# EAGLE board MainECU rev12 (EAGLE 9.6.2), part 1 of 2
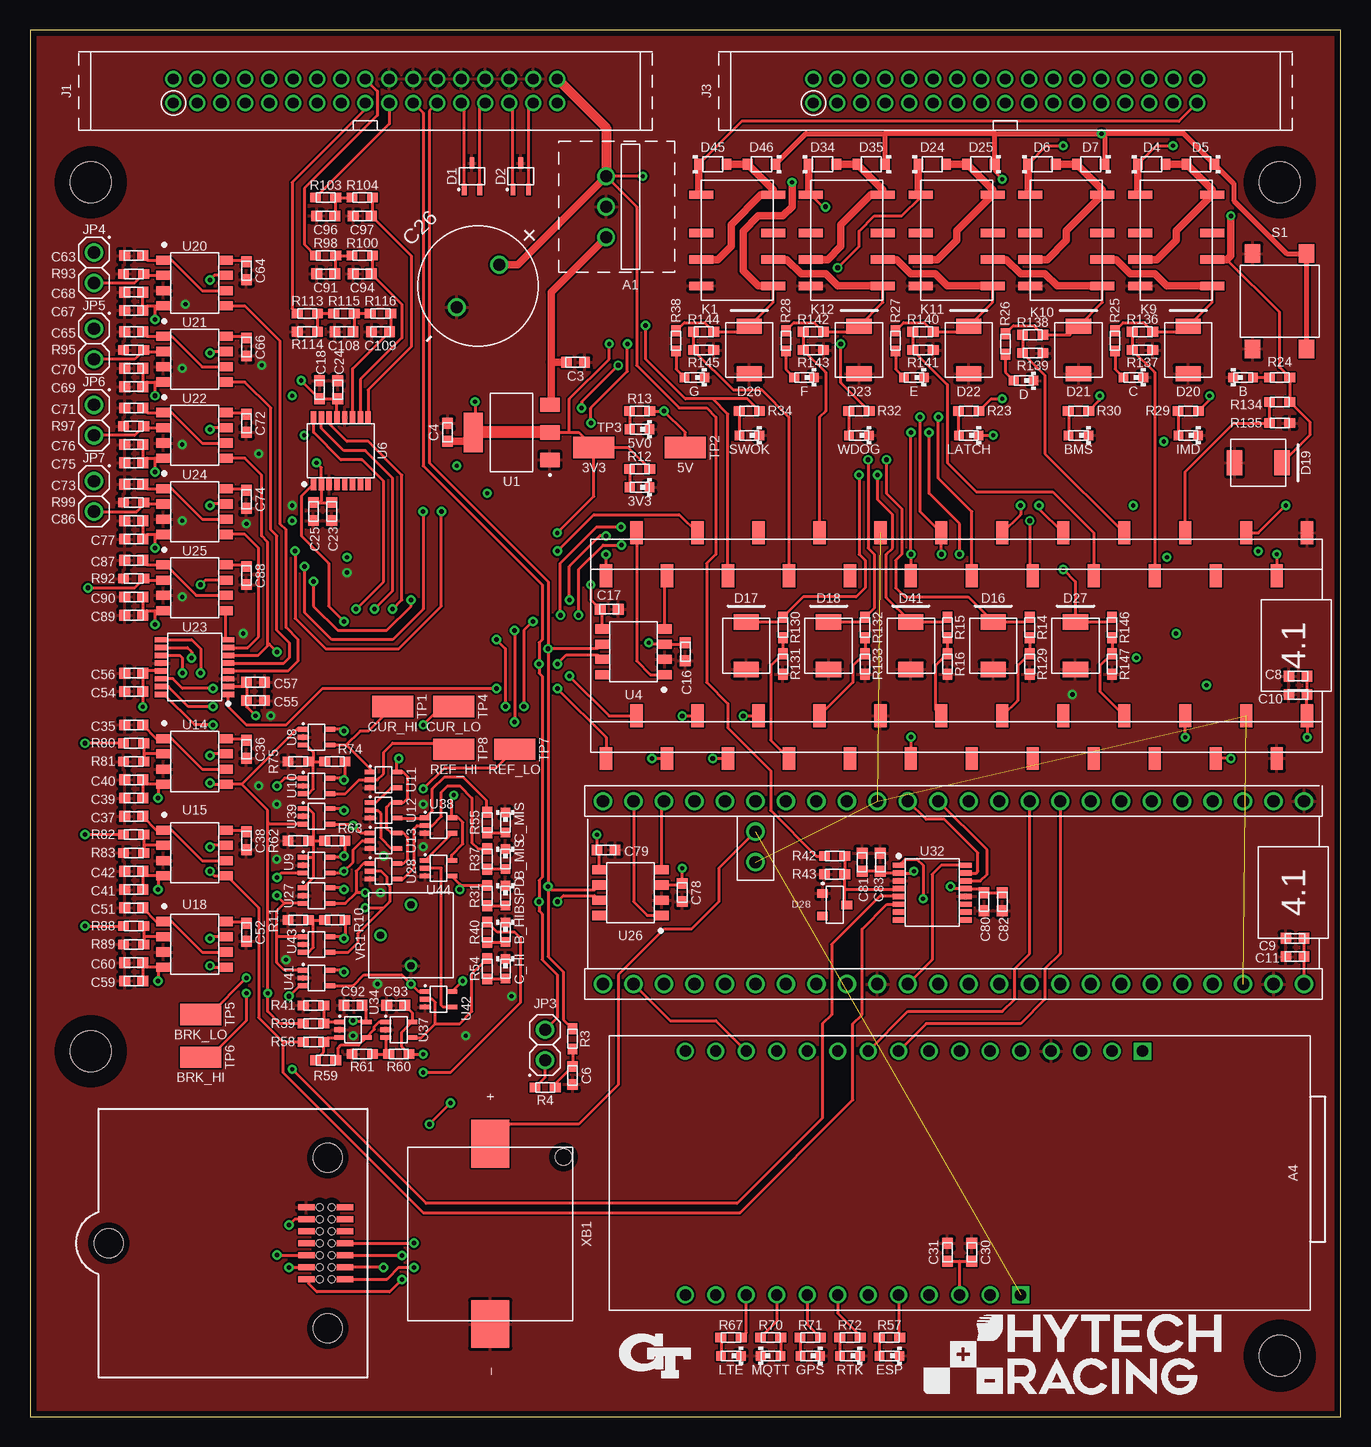
[diagram p8: board, top side]
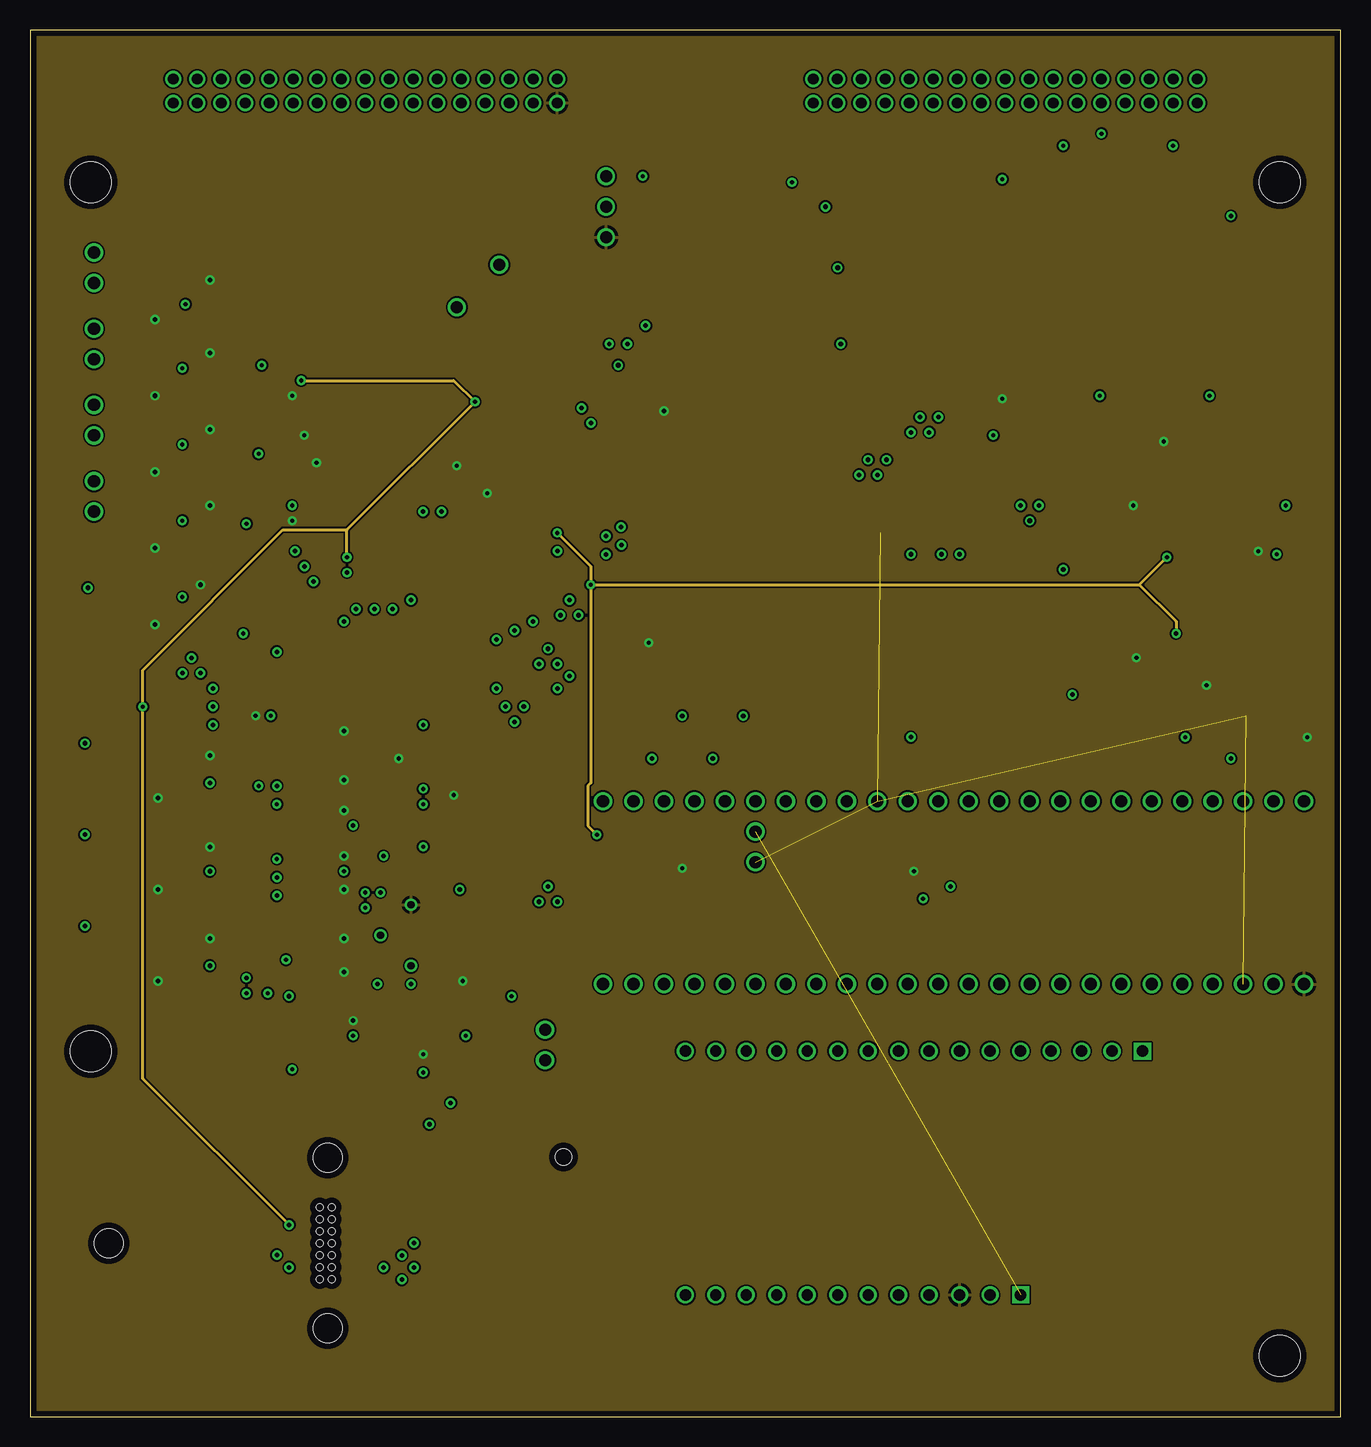
[diagram p9: board, inner layer Route2]
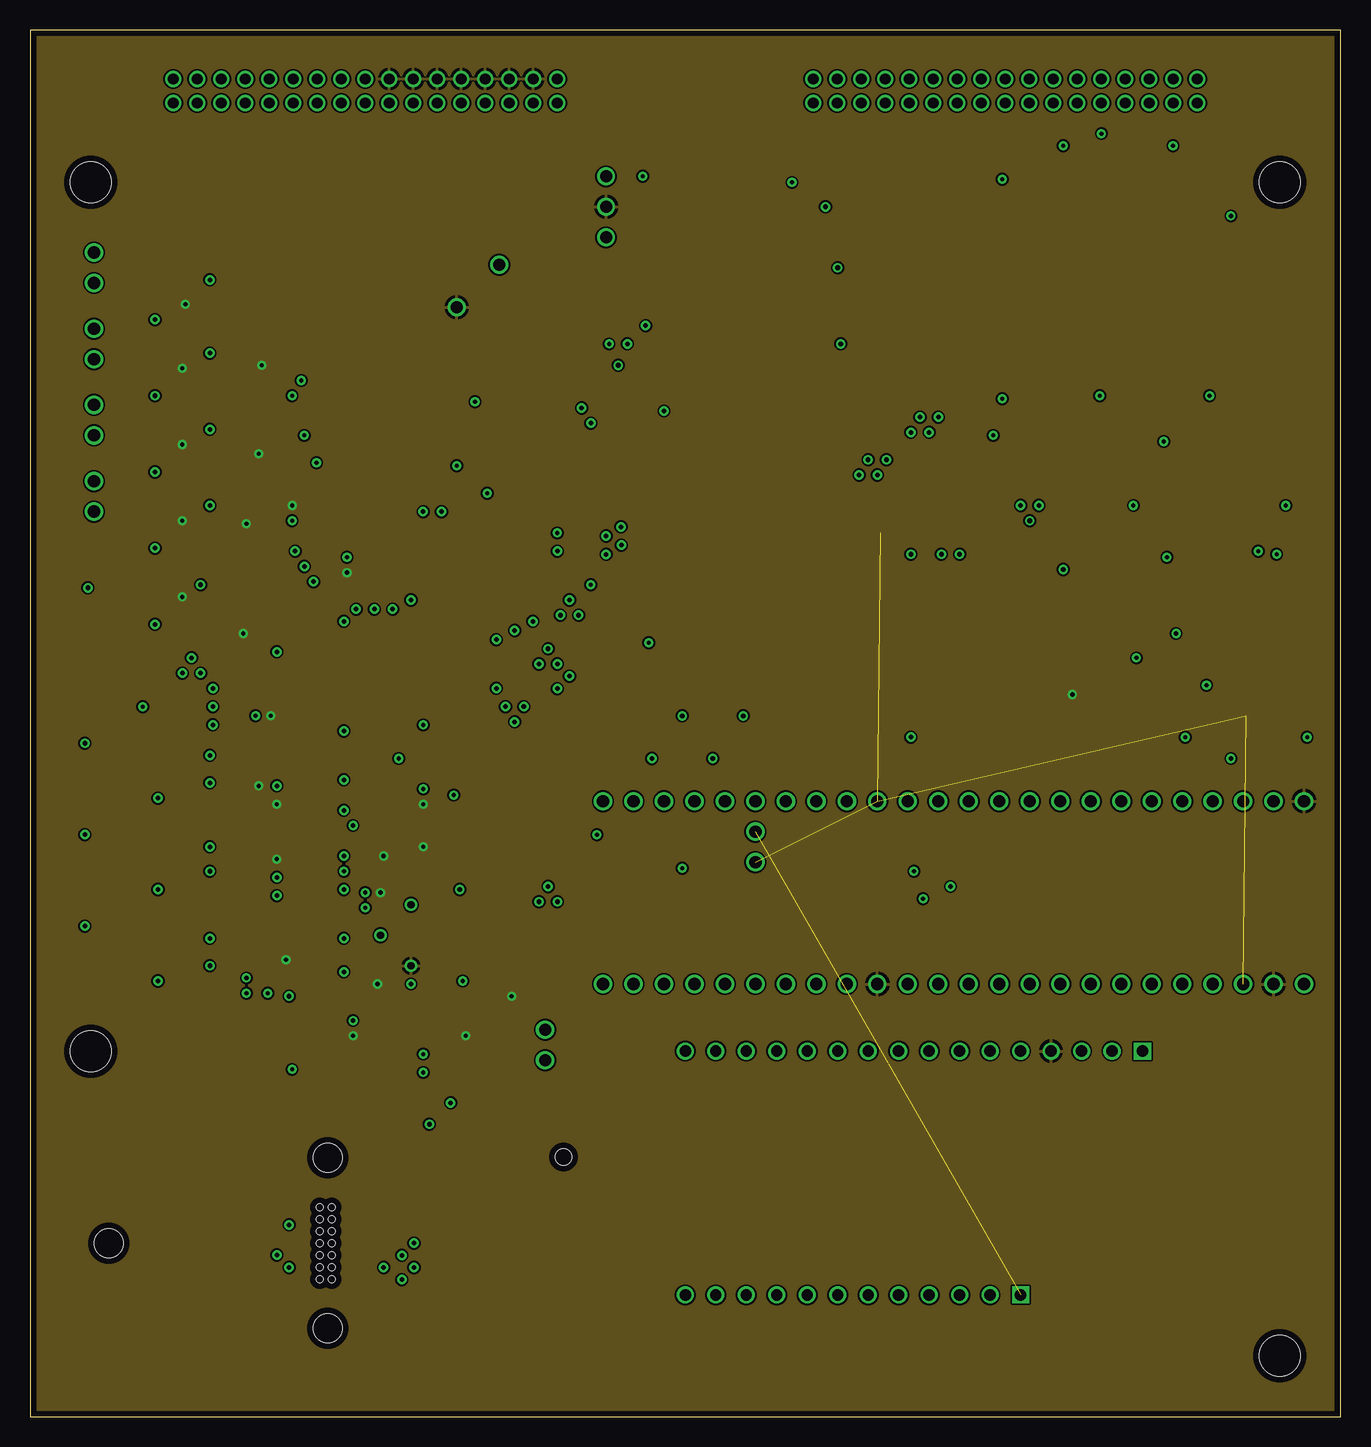
[diagram p10: board, inner layer Route15]
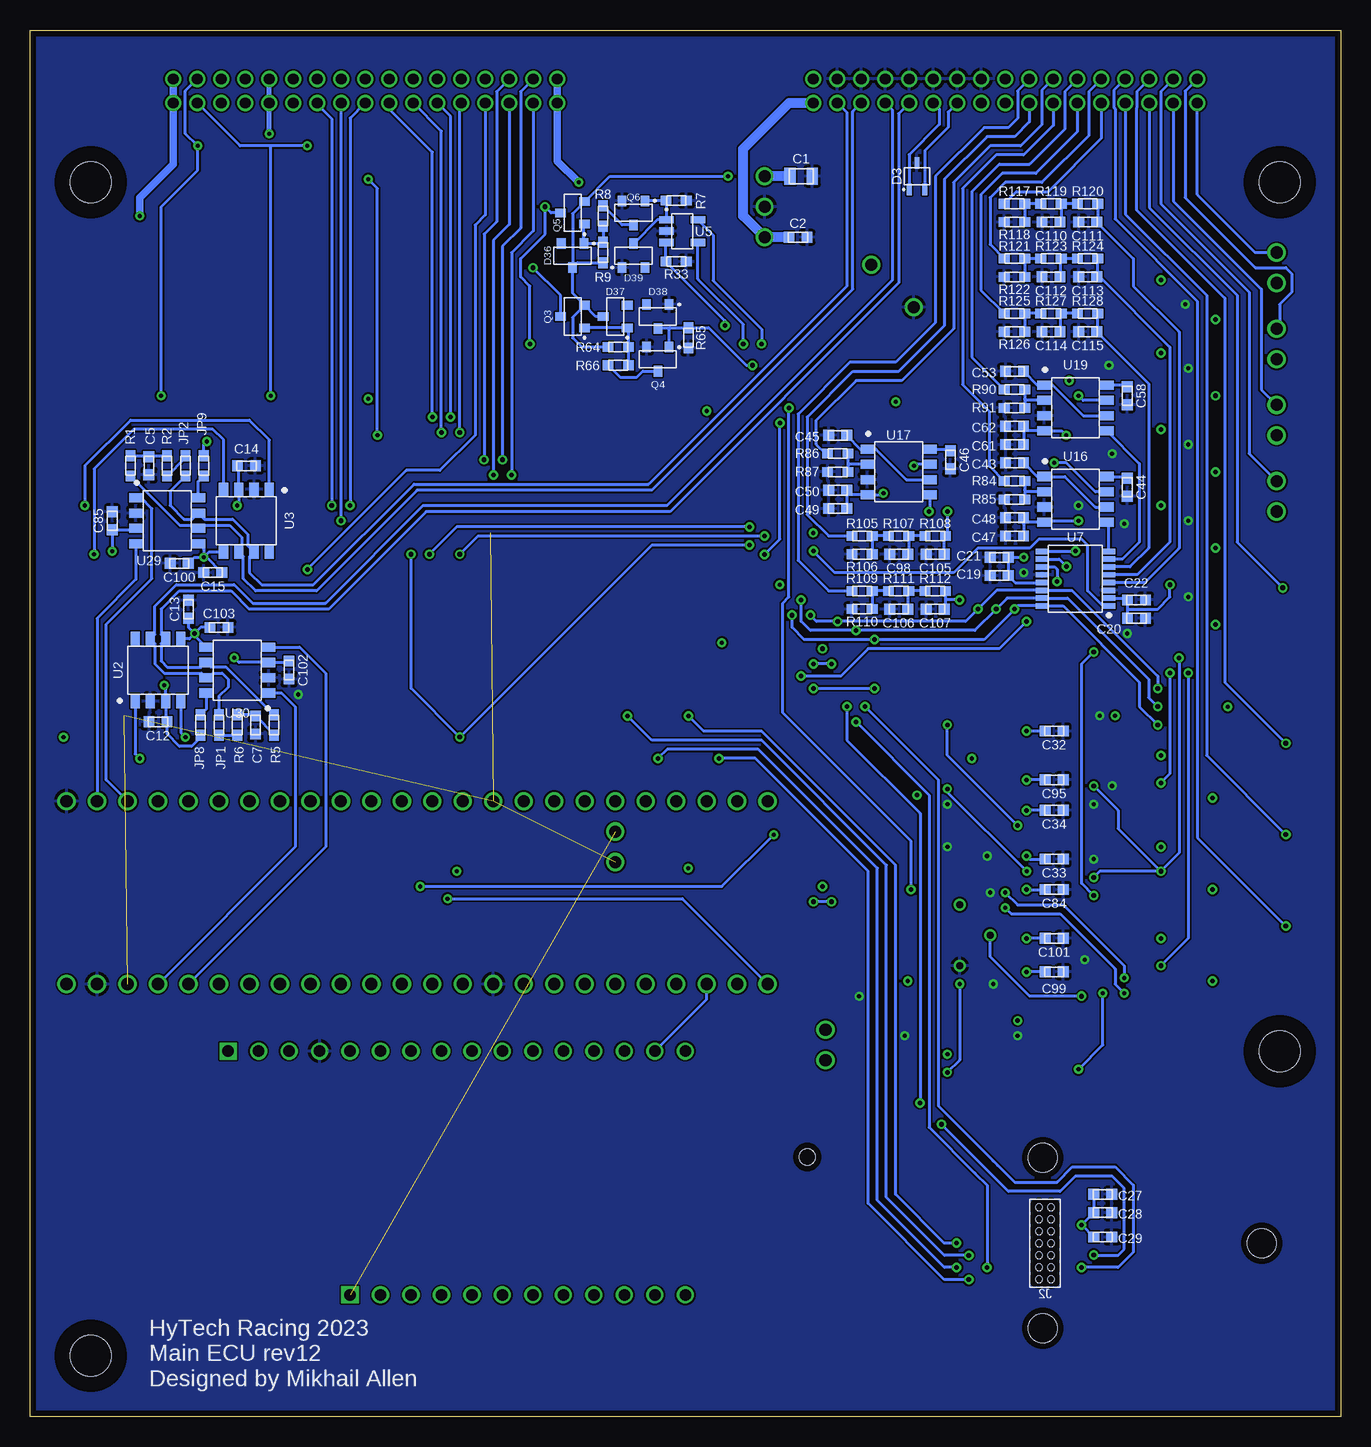
[diagram p11: board, bottom side, seen from below]

Size 109.22 x 115.57 mm. Coordinates in mm from the lower left corner, seen from the top.
Outline: 0,0 109.22,0 109.22,115.57 0,115.57 0,0
Copper layers (1+2*15+16): Top 0.035mm / dielectric 0.2mm / Route2 0.0175mm / dielectric 1.065mm / Route15 0.0175mm / dielectric 0.2mm / Bottom 0.035mm
Design rules "HyTech Default (4 Layer)": minimum track width 6mil, minimum drill 10mil, track to track 6mil, track to pad 6mil, pad to pad 6mil, via to via 20mil, smd to smd 6mil, copper to edge 20mil, drill to drill 21mil, minimum pad ring 8mil, minimum via ring 8mil, stop-mask expansion 3mil, vias tented up to drill 30mil, thermal gap 10mil

## Footprints (pad centres in the part's own frame; a part is rotated, then mirrored left to right if it is on the bottom)
0603-LED = smd 0.8 x 0.8: 1 -0.825,0; 2 0.825,0
OKI-78SR = drill 0.991: 1 -2.54,0; 2 0,0; 3 2.54,0
TEENSY_LONG_SSM = smd 1.905 x 1.02: 3.3V -5.842,-24.13; 3.3V@1 9.398,6.35; AGND/GND -9.398,-26.67; D0 5.842,-26.67; D1 9.398,-24.13; D2 5.842,-21.59; D3 9.398,-19.05; D4 5.842,-16.51; D5 9.398,-13.97; D6 5.842,-11.43; D7 9.398,-8.89; D8 5.842,-6.35; D9 9.398,-3.81; D10 5.842,-1.27; D11 9.398,1.27; D12 5.842,3.81; D13 -9.398,3.81; D14 -5.842,1.27; D15 -9.398,-1.27; D16 -5.842,-3.81; D17 -9.398,-6.35; D18 -5.842,-8.89; D19 -9.398,-11.43; D20 -5.842,-13.97; D21 -9.398,-16.51; D22 -5.842,-19.05; D23 -9.398,-21.59; D24 5.842,8.89; D25 9.398,11.43; D26 5.842,13.97; D27 9.398,16.51; D28 5.842,19.05; D29 9.398,21.59; D30 5.842,24.13; D31 9.398,26.67; D32 5.842,29.21; D33 -9.398,29.21; D34 -5.842,26.67; D35 -9.398,24.13; D36 -5.842,21.59; D37 -9.398,19.05; D38 -5.842,16.51; D39 -9.398,13.97; D40 -5.842,11.43; D41 -9.398,8.89; GND 9.398,-29.21; GND@1 -5.842,6.35; VIN -5.842,-29.21
TEENSY_LONG_EXT = drill 1.016: 3V3 0,5.08; 3V3@2 15.24,35.56; 3V3@3 10.16,45.72; AGND/GND 0,2.54; D0 15.24,2.54; D1 15.24,5.08; D2 15.24,7.62; D3 15.24,10.16; D4 15.24,12.7; D5 15.24,15.24; D6 15.24,17.78; D7 15.24,20.32; D8 15.24,22.86; D9 15.24,25.4; D10 15.24,27.94; D11 15.24,30.48; D12 15.24,33.02; D13 0,33.02; D14 0,30.48; D15 0,27.94; D16 0,25.4; D17 0,22.86; D18 0,20.32; D19 0,17.78; D20 0,15.24; D21 0,12.7; D22 0,10.16; D23 0,7.62; D24 15.24,38.1; D25 15.24,40.64; D26 15.24,43.18; D27 15.24,45.72; D28 15.24,48.26; D29 15.24,50.8; D30 15.24,53.34; D31 15.24,55.88; D32 15.24,58.42; D33 0,58.42; D34 0,55.88; D35 0,53.34; D36 0,50.8; D37 0,48.26; D38 0,45.72; D39 0,43.18; D40 0,40.64; D41 0,38.1; GND 15.24,0; GND@2 0,35.56; VBAT 12.7,45.72; VIN 0,0
NRF9160LTE = drill 0.95: 2 -10.16,46.99; 3 -10.16,44.45; 3V3 10.16,16.51; 4 -10.16,41.91; 5 -10.16,39.37; 6 -10.16,36.83; 7 -10.16,34.29; 8 -10.16,31.75; A0 10.16,24.13; A1 10.16,26.67; A2 10.16,29.21; A3 10.16,31.75; A4 10.16,34.29; A5 10.16,36.83; CIPO 10.16,44.45; COPI 10.16,41.91; EN -10.16,26.67; GND 10.16,21.59; MD 10.16,19.05; PS-EN 10.16,52.07; RX 10.16,46.99; SCK 10.16,39.37; SCL/1 -10.16,49.53; SDA/0 -10.16,52.07; TX 10.16,49.53; VUSB -10.16,29.21 | drill 0.95 square: RESET 10.16,13.97; VBAT -10.16,24.13
0805-CAP = smd 0.95 x 1.4: 1 -0.925,0; 2 0.925,0
0603-CAP = smd 0.9 x 0.9: 1 -0.75,0; 2 0.75,0
EEH-AZS = drill 1: MINUS 2.5,0; PLUS -2.5,0
SC-70-3 = smd 0.95 x 0.4: 1 -1.1,0.65; 2 -1.1,-0.65; 3 1.1,0
SOD-323 = smd 0.8 x 0.9: A -1.15,0; C 1.15,0
DO-214AA = smd 1.27 x 2.1: 1 -1.98,0; 2 1.98,0
SOT-23 = smd 0.711 x 0.889: 1 -0.94,-1.003; 2 0.94,-1.003; 3 0,1.003
EHT-117-01 = drill 0.9: 1 -16,-1; 2 -16,1; 3 -14,-1; 4 -14,1; 5 -12,-1; 6 -12,1; 7 -10,-1; 8 -10,1; 9 -8,-1; 10 -8,1; 11 -6,-1; 12 -6,1; 13 -4,-1; 14 -4,1; 15 -2,-1; 16 -2,1; 17 0,-1; 18 0,1; 19 2,-1; 20 2,1; 21 4,-1; 22 4,1; 23 6,-1; 24 6,1; 25 8,-1; 26 8,1; 27 10,-1; 28 10,1; 29 12,-1; 30 12,1; 31 14,-1; 32 14,1; 33 16,-1; 34 16,1
ADIS16460 = smd 0.5 x 1.37: 1 -3,1.6; 2 -3,-1.6; 3 -2,1.6; 4 -2,-1.6; 5 -1,1.6; 6 -1,-1.6; 7 0,1.6; 8 0,-1.6; 9 1,1.6; 10 1,-1.6; 11 2,1.6; 12 2,-1.6; 13 3,1.6; 14 3,-1.6 | hole 0.56: 0,-0.5; 0,0.5; -1,0.5; -1,-0.5; -2,0.5; -2,-0.5; 1,0.5; 1,-0.5; 2,0.5; 2,-0.5; -3,0.5; -3,-0.5; 3,0.5; 3,-0.5 | hole 2.4: -7.1,-0.19; 7.1,-0.19; 0,18.06
0603-RES = smd 0.9 x 0.8: 1 -0.85,0; 2 0.85,0
1X02 = drill 1.016: 1 -1.27,0; 2 1.27,0
IM*G = smd 0.7 x 2: 1 -3.8,-3; 2 -0.6,-3; 3 1.6,-3; 4 3.8,-3; 5 3.8,3; 6 1.6,3; 7 -0.6,3; 8 -3.8,3
B3S-100X = smd 1.55 x 1.3: 1 3.975,-2.25; 2 -3.975,-2.25; 3 3.975,2.25; 4 -3.975,2.25
5015 = smd 3.429 x 1.778: 1 0,0
SOT-223 = smd 1.2 x 1.6: 1 -2.3,-3.2; 2 0,-3.2; 3 2.3,-3.2 | smd 3.3 x 1.6: 4 0,3.2
SOIC-08(NARROW,0.15") = smd 0.762 x 1.143: 1 -1.905,-2.603; 2 -0.635,-2.603; 3 0.635,-2.603; 4 1.905,-2.603; 5 1.905,2.603; 6 0.635,2.603; 7 -0.635,2.603; 8 -1.905,2.603
SOT-23-5 = smd 0.62 x 1.22: 1 -0.95,-1.31; 2 0,-1.31; 3 0.95,-1.31; 4 0.95,1.31; 5 -0.95,1.31
TSSOP-16 = smd 0.45 x 1.05: 1 -2.275,-2.775; 2 -1.625,-2.775; 3 -0.975,-2.775; 4 -0.325,-2.775; 5 0.325,-2.775; 6 0.975,-2.775; 7 1.625,-2.775; 8 2.275,-2.775; 9 2.275,2.775; 10 1.625,2.775; 11 0.975,2.775; 12 0.325,2.775; 13 -0.325,2.775; 14 -0.975,2.775; 15 -1.625,2.775; 16 -2.275,2.775
SC-70-5 = smd 0.4 x 0.9: 1 -0.65,-1.1; 2 0,-1.1; 3 0.65,-1.1; 4 0.65,1.1; 5 -0.65,1.1
MOUNTING_M3 = hole 3.4: 0,0
3362P = drill 0.6: 1 -2.54,0; 2 0,2.54; 3 2.54,0
498 = smd 3.962 x 3.175: 1 -7.518,0; 2 7.518,0 | hole 1.346: -6.426,6.096

## Placement (x,y rotation side)
3V3  LED_0603_YELLOW  [0603-LED]  50.8,77.47 180 top
5V0  LED_0603_YELLOW  [0603-LED]  50.8,82.3 180 top
A1  VOLTAGE_REGULATOR_MODULE_OKI-78SR_5V  [OKI-78SR]  48.01,100.84 270 top
A2  TEENSY_4.1_SMT  [TEENSY_LONG_SSM]  77.22,64.26 90 top
A3  TEENSY_4.1  [TEENSY_LONG_EXT]  106.17,36.07 90 top
A4  NRF9160LTE  [NRF9160LTE]  106.68,20.32 90 top
B  LED_0603_GREEN  [0603-LED]  101.09,86.61 0 top
B_HI  LED_0603_RED  [0603-LED]  39.62,40.39 270 top
B_MIS  LED_0603_RED  [0603-LED]  39.62,46.48 270 top
BMS  LED_0603_ORANGE  [0603-LED]  87.38,81.79 180 top
BSPD  LED_0603_GREEN  [0603-LED]  39.62,43.43 270 top
C  LED_0603_GREEN  [0603-LED]  91.95,86.61 180 top
C1  CAPACITOR_0805_50V_10UF  [0805-CAP]  44.96,103.38 0 bottom
C2  CAPACITOR_0603_25V_10UF  [0603-CAP]  45.21,98.3 0 bottom
C3  CAPACITOR_0603_25V_10UF  [0603-CAP]  45.47,87.88 0 top
C4  CAPACITOR_0603_25V_10UF  [0603-CAP]  34.8,82.04 90 top
C5  CAPACITOR_0603_10V_4.7NF  [0603-CAP]  99.31,79.25 270 bottom
C6  CAPACITOR_0603_10V_4.7NF  [0603-CAP]  45.21,28.45 270 top
C7  CAPACITOR_0603_10V_4.7NF  [0603-CAP]  90.42,57.66 270 bottom
C8  CAPACITOR_0603_10V_0.1UF  [0603-CAP]  105.66,61.72 180 top
C9  CAPACITOR_0603_10V_0.1UF  [0603-CAP]  105.41,39.88 180 top
C10  CAPACITOR_0603_10V_1UF  [0603-CAP]  105.66,60.2 180 top
C11  CAPACITOR_0603_10V_1UF  [0603-CAP]  105.41,38.35 180 top
C12  CAPACITOR_0603_10V_0.1UF  [0603-CAP]  98.55,57.91 180 bottom
C13  CAPACITOR_0603_10V_0.1UF  [0603-CAP]  96.01,67.31 90 bottom
C14  CAPACITOR_0603_10V_0.1UF  [0603-CAP]  91.19,79.25 0 bottom
C15  CAPACITOR_0603_10V_0.1UF  [0603-CAP]  93.98,70.36 180 bottom
C16  CAPACITOR_0603_10V_0.1UF  [0603-CAP]  54.61,63.75 270 top
C17  CAPACITOR_0603_10V_0.1UF  [0603-CAP]  48.26,67.31 0 top
C18  CAPACITOR_0603_10V_0.1UF  [0603-CAP]  24.13,85.6 90 top
C19  CAPACITOR_0603_10V_0.1UF  [0603-CAP]  28.45,70.1 180 bottom
C20  CAPACITOR_0603_10V_0.1UF  [0603-CAP]  17.02,66.55 0 bottom
C21  CAPACITOR_0603_10V_1UF  [0603-CAP]  28.45,71.63 180 bottom
C22  CAPACITOR_0603_10V_1UF  [0603-CAP]  17.02,68.07 0 bottom
C23  CAPACITOR_0603_10V_0.1UF  [0603-CAP]  25.15,75.44 270 top
C24  CAPACITOR_0603_10V_1UF  [0603-CAP]  25.65,85.6 90 top
C25  CAPACITOR_0603_10V_1UF  [0603-CAP]  23.62,75.44 270 top
C26  CAPACITOR_ELECTROLYTIC_EEH_AZS_470UF  [EEH-AZS]  37.34,94.23 225 top
C27  CAPACITOR_0603_25V_10UF  [0603-CAP]  19.81,18.54 0 bottom
C28  CAPACITOR_0603_25V_1UF  [0603-CAP]  19.81,17.02 0 bottom
C29  CAPACITOR_0603_25V_0.1UF  [0603-CAP]  19.81,14.99 0 bottom
C30  CAPACITOR_0603_10V_0.1UF  [0603-CAP]  78.49,13.72 90 top
C31  CAPACITOR_0603_10V_1UF  [0603-CAP]  76.45,13.72 90 top
C32  CAPACITOR_0603_10V_0.1UF  [0603-CAP]  23.88,57.15 0 bottom
C33  CAPACITOR_0603_10V_0.1UF  [0603-CAP]  23.88,46.48 0 bottom
C34  CAPACITOR_0603_10V_0.1UF  [0603-CAP]  23.88,50.55 0 bottom
C35  CAPACITOR_0603_10V_0.1UF  [0603-CAP]  8.64,57.66 180 top
C36  CAPACITOR_0603_10V_680PF  [0603-CAP]  18.03,55.63 270 top
C37  CAPACITOR_0603_10V_0.1UF  [0603-CAP]  8.64,50.04 180 top
C38  CAPACITOR_0603_10V_680PF  [0603-CAP]  18.03,48.01 270 top
C39  CAPACITOR_0603_10V_0.1UF  [0603-CAP]  8.64,51.56 180 top
C40  CAPACITOR_0603_10V_1UF  [0603-CAP]  8.64,53.09 180 top
C41  CAPACITOR_0603_10V_0.1UF  [0603-CAP]  8.64,43.94 180 top
C42  CAPACITOR_0603_10V_1UF  [0603-CAP]  8.64,45.47 180 top
C43  CAPACITOR_0603_10V_0.1UF  [0603-CAP]  27.18,79.5 180 bottom
C44  CAPACITOR_0603_10V_680PF  [0603-CAP]  17.78,77.47 270 bottom
C45  CAPACITOR_0603_10V_0.1UF  [0603-CAP]  41.91,81.79 180 bottom
C46  CAPACITOR_0603_10V_680PF  [0603-CAP]  32.51,79.76 270 bottom
C47  CAPACITOR_0603_10V_0.1UF  [0603-CAP]  27.18,73.41 180 bottom
C48  CAPACITOR_0603_10V_1UF  [0603-CAP]  27.18,74.93 180 bottom
C49  CAPACITOR_0603_10V_0.1UF  [0603-CAP]  41.91,75.69 180 bottom
C50  CAPACITOR_0603_10V_1UF  [0603-CAP]  41.91,77.22 180 bottom
C51  CAPACITOR_0603_10V_0.1UF  [0603-CAP]  8.64,42.42 180 top
C52  CAPACITOR_0603_10V_680PF  [0603-CAP]  18.03,40.39 270 top
C53  CAPACITOR_0603_10V_0.1UF  [0603-CAP]  27.18,87.12 180 bottom
C54  CAPACITOR_0603_10V_0.1UF  [0603-CAP]  8.64,60.45 180 top
C55  CAPACITOR_0603_10V_0.1UF  [0603-CAP]  18.8,59.69 0 top
C56  CAPACITOR_0603_10V_1UF  [0603-CAP]  8.64,61.98 180 top
C57  CAPACITOR_0603_10V_1UF  [0603-CAP]  18.8,61.21 0 top
C58  CAPACITOR_0603_10V_680PF  [0603-CAP]  17.78,85.09 270 bottom
C59  CAPACITOR_0603_10V_0.1UF  [0603-CAP]  8.64,36.32 180 top
C60  CAPACITOR_0603_10V_1UF  [0603-CAP]  8.64,37.85 180 top
C61  CAPACITOR_0603_10V_0.1UF  [0603-CAP]  27.18,81.03 180 bottom
C62  CAPACITOR_0603_10V_1UF  [0603-CAP]  27.18,82.55 180 bottom
C63  CAPACITOR_0603_10V_0.1UF  [0603-CAP]  8.64,96.77 180 top
C64  CAPACITOR_0603_10V_680PF  [0603-CAP]  18.03,95.5 270 top
C65  CAPACITOR_0603_10V_0.1UF  [0603-CAP]  8.64,90.42 180 top
C66  CAPACITOR_0603_10V_680PF  [0603-CAP]  18.03,89.15 270 top
C67  CAPACITOR_0603_10V_0.1UF  [0603-CAP]  8.64,92.2 180 top
C68  CAPACITOR_0603_10V_1UF  [0603-CAP]  8.64,93.73 180 top
C69  CAPACITOR_0603_10V_0.1UF  [0603-CAP]  8.64,85.85 180 top
C70  CAPACITOR_0603_10V_1UF  [0603-CAP]  8.64,87.38 180 top
C71  CAPACITOR_0603_10V_0.1UF  [0603-CAP]  8.64,84.07 180 top
C72  CAPACITOR_0603_10V_680PF  [0603-CAP]  18.03,82.8 270 top
C73  CAPACITOR_0603_10V_0.1UF  [0603-CAP]  8.64,77.72 180 top
C74  CAPACITOR_0603_10V_680PF  [0603-CAP]  18.03,76.45 270 top
C75  CAPACITOR_0603_10V_0.1UF  [0603-CAP]  8.64,79.5 180 top
C76  CAPACITOR_0603_10V_1UF  [0603-CAP]  8.64,81.03 180 top
C77  CAPACITOR_0603_10V_0.1UF  [0603-CAP]  8.64,73.15 180 top
C78  CAPACITOR_0603_10V_0.1UF  [0603-CAP]  54.36,43.69 270 top
C79  CAPACITOR_0603_10V_0.1UF  [0603-CAP]  48.01,47.24 0 top
C80  CAPACITOR_0603_10V_0.1UF  [0603-CAP]  79.5,42.93 270 top
C81  CAPACITOR_0603_10V_0.1UF  [0603-CAP]  69.34,46.23 90 top
C82  CAPACITOR_0603_10V_1UF  [0603-CAP]  81.03,42.93 270 top
C83  CAPACITOR_0603_10V_1UF  [0603-CAP]  70.87,46.23 90 top
C84  CAPACITOR_0603_10V_0.1UF  [0603-CAP]  23.88,43.94 0 bottom
C85  CAPACITOR_0603_10V_0.1UF  [0603-CAP]  102.36,74.68 90 bottom
C86  CAPACITOR_0603_10V_1UF  [0603-CAP]  8.64,74.68 180 top
C87  CAPACITOR_0603_10V_0.1UF  [0603-CAP]  8.64,71.37 180 top
C88  CAPACITOR_0603_10V_680PF  [0603-CAP]  18.03,70.1 270 top
C89  CAPACITOR_0603_10V_0.1UF  [0603-CAP]  8.64,66.8 180 top
C90  CAPACITOR_0603_10V_1UF  [0603-CAP]  8.64,68.33 180 top
C91  CAPACITOR_0603_10V_680PF  [0603-CAP]  24.64,95.25 180 top
C92  CAPACITOR_0603_10V_0.1UF  [0603-CAP]  26.92,34.29 180 top
C93  CAPACITOR_0603_10V_0.1UF  [0603-CAP]  30.48,34.29 180 top
C94  CAPACITOR_0603_10V_680PF  [0603-CAP]  27.69,95.25 180 top
C95  CAPACITOR_0603_10V_0.1UF  [0603-CAP]  23.88,53.09 0 bottom
C96  CAPACITOR_0603_10V_680PF  [0603-CAP]  24.64,100.08 180 top
C97  CAPACITOR_0603_10V_680PF  [0603-CAP]  27.69,100.08 180 top
C98  CAPACITOR_0603_10V_680PF  [0603-CAP]  36.83,71.88 180 bottom
C99  CAPACITOR_0603_10V_0.1UF  [0603-CAP]  23.88,37.08 0 bottom
C100  CAPACITOR_0603_10V_0.1UF  [0603-CAP]  96.77,71.12 180 bottom
C101  CAPACITOR_0603_10V_0.1UF  [0603-CAP]  23.88,39.88 0 bottom
C102  CAPACITOR_0603_10V_0.1UF  [0603-CAP]  87.63,62.23 270 bottom
C103  CAPACITOR_0603_10V_0.1UF  [0603-CAP]  93.47,65.79 0 bottom
C105  CAPACITOR_0603_10V_680PF  [0603-CAP]  33.78,71.88 180 bottom
C106  CAPACITOR_0603_10V_680PF  [0603-CAP]  36.83,67.31 180 bottom
C107  CAPACITOR_0603_10V_680PF  [0603-CAP]  33.78,67.31 180 bottom
C108  CAPACITOR_0603_10V_680PF  [0603-CAP]  26.16,90.42 180 top
C109  CAPACITOR_0603_10V_680PF  [0603-CAP]  29.21,90.42 180 top
C110  CAPACITOR_0603_10V_680PF  [0603-CAP]  24.13,99.57 180 bottom
C111  CAPACITOR_0603_10V_680PF  [0603-CAP]  21.08,99.57 180 bottom
C112  CAPACITOR_0603_10V_680PF  [0603-CAP]  24.13,95 180 bottom
C113  CAPACITOR_0603_10V_680PF  [0603-CAP]  21.08,95 180 bottom
C114  CAPACITOR_0603_10V_680PF  [0603-CAP]  24.13,90.42 180 bottom
C115  CAPACITOR_0603_10V_680PF  [0603-CAP]  21.08,90.42 180 bottom
C_HI  LED_0603_RED  [0603-LED]  39.62,37.34 270 top
C_MIS  LED_0603_RED  [0603-LED]  39.62,49.53 270 top
D  LED_0603_GREEN  [0603-LED]  82.8,86.36 180 top
D1  TVS_BIDIRECTIONAL_DUAL  [SC-70-3]  36.83,103.38 90 top
D2  TVS_BIDIRECTIONAL_DUAL  [SC-70-3]  40.89,103.38 90 top
D3  TVS_BIDIRECTIONAL_DUAL  [SC-70-3]  35.31,103.38 90 bottom
D4  SCHOTTKY_SOD323_30V  [SOD-323]  93.47,104.39 180 top
D5  SCHOTTKY_SOD323_30V  [SOD-323]  97.54,104.39 0 top
D6  SCHOTTKY_SOD323_30V  [SOD-323]  84.33,104.39 180 top
D7  SCHOTTKY_SOD323_30V  [SOD-323]  88.39,104.39 0 top
D16  TVS_DO-214AA_28V  [DO-214AA]  80.26,64.26 90 top
D17  TVS_DO-214AA_28V  [DO-214AA]  59.69,64.26 90 top
D18  TVS_DO-214AA_28V  [DO-214AA]  66.55,64.26 90 top
D19  TVS_DO-214AA_28V  [DO-214AA]  102.36,79.5 0 top
D20  TVS_DO-214AA_28V  [DO-214AA]  96.52,88.9 90 top
D21  TVS_DO-214AA_28V  [DO-214AA]  87.38,88.9 90 top
D22  TVS_DO-214AA_28V  [DO-214AA]  78.23,88.9 90 top
D23  TVS_DO-214AA_28V  [DO-214AA]  69.09,88.9 90 top
D24  SCHOTTKY_SOD323_30V  [SOD-323]  75.18,104.39 180 top
D25  SCHOTTKY_SOD323_30V  [SOD-323]  79.25,104.39 0 top
D26  TVS_DO-214AA_28V  [DO-214AA]  59.94,88.9 90 top
D27  TVS_DO-214AA_28V  [DO-214AA]  87.12,64.26 90 top
D28  TVS__5V  [SOT-23]  67.06,42.67 270 top
D34  SCHOTTKY_SOD323_30V  [SOD-323]  66.04,104.39 180 top
D35  SCHOTTKY_SOD323_30V  [SOD-323]  70.1,104.39 0 top
D36  TVS__15V  [SOT-23]  64.01,96.77 180 bottom
D37  TVS__15V  [SOT-23]  60.45,91.69 90 bottom
D38  TVS__15V  [SOT-23]  56.9,91.69 180 bottom
D39  TVS__15V  [SOT-23]  58.93,96.77 0 bottom
D41  TVS_DO-214AA_28V  [DO-214AA]  73.41,64.26 90 top
D45  SCHOTTKY_SOD323_30V  [SOD-323]  56.9,104.39 180 top
D46  SCHOTTKY_SOD323_30V  [SOD-323]  60.96,104.39 0 top
E  LED_0603_GREEN  [0603-LED]  73.66,86.61 180 top
ESP  LED_0603_RED  [0603-LED]  71.63,5.08 180 top
F  LED_0603_GREEN  [0603-LED]  64.52,86.61 180 top
G  LED_0603_GREEN  [0603-LED]  55.37,86.61 180 top
GPS  LED_0603_RED  [0603-LED]  65.02,5.08 180 top
IMD  LED_0603_ORANGE  [0603-LED]  96.52,81.79 180 top
J1  CONNECTOR-34__  [EHT-117-01]  27.94,110.49 0 top
J2  ADIS16460  [ADIS16460]  24.64,14.48 90 top
J3  CONNECTOR-34__  [EHT-117-01]  81.28,110.49 0 top
JP1  JUMPER_0603_  [0603-RES]  93.47,57.66 90 bottom
JP2  JUMPER_0603_  [0603-RES]  96.27,79.25 270 bottom
JP3  JUMPER__1X02  [1X02]  42.93,30.99 90 top
JP4  JUMPER__1X02  [1X02]  5.33,95.76 270 top
JP5  JUMPER__1X02  [1X02]  5.33,89.41 270 top
JP6  JUMPER__1X02  [1X02]  5.33,83.06 270 top
JP7  JUMPER__1X02  [1X02]  5.33,76.71 270 top
JP8  JUMPER_0603_  [0603-RES]  95,57.66 270 bottom
JP9  JUMPER_0603_  [0603-RES]  94.74,79.25 90 bottom
K1  RELAY_DPDT_07DSMT  [IM*G]  58.93,98.04 270 top
K9  RELAY_DPDT_07DSMT  [IM*G]  95.5,98.04 270 top
K10  RELAY_DPDT_07DSMT  [IM*G]  86.36,98.04 270 top
K11  RELAY_DPDT_07DSMT  [IM*G]  77.22,98.04 270 top
K12  RELAY_DPDT_07DSMT  [IM*G]  68.07,98.04 270 top
LATCH  LED_0603_WHITE  [0603-LED]  78.23,81.79 180 top
LTE  LED_0603_RED  [0603-LED]  58.42,5.08 180 top
MQTT  LED_0603_RED  [0603-LED]  61.72,5.08 0 top
Q3  TRANSISTOR_P_MOS_SOT-23_DMP3056L-7  [SOT-23]  64.01,91.69 90 bottom
Q4  TRANSISTOR_N_MOS__DMG3406L-7  [SOT-23]  56.9,88.14 180 bottom
Q5  TRANSISTOR_P_MOS_SOT-23_DMP3056L-7  [SOT-23]  64.01,100.33 90 bottom
Q6  TRANSISTOR_N_MOS__DMG3406L-7  [SOT-23]  58.93,100.33 180 bottom
R1  RESISTOR_0603_60.4  [0603-RES]  100.84,79.25 90 bottom
R2  RESISTOR_0603_60.4  [0603-RES]  97.79,79.25 270 bottom
R3  RESISTOR_0603_60.4  [0603-RES]  45.21,31.5 270 top
R4  RESISTOR_0603_60.4  [0603-RES]  42.93,27.43 180 top
R5  RESISTOR_0603_60.4  [0603-RES]  88.9,57.66 270 bottom
R6  RESISTOR_0603_60.4  [0603-RES]  91.95,57.66 270 bottom
R7  RESISTOR_0603_10K  [0603-RES]  55.37,101.35 180 bottom
R8  RESISTOR_0603_5.1K  [0603-RES]  61.47,100.08 270 bottom
R9  RESISTOR_0603_5.1K  [0603-RES]  61.47,97.03 270 bottom
R10  RESISTOR_0603_1.13K  [0603-RES]  25.4,41.4 0 top
R11  RESISTOR_0603_10.2K  [0603-RES]  22.35,41.4 0 top
R12  RESISTOR_0603_120  [0603-RES]  50.8,78.99 180 top
R13  RESISTOR_0603_240  [0603-RES]  50.8,83.82 180 top
R14  RESISTOR_0603_36.5K  [0603-RES]  83.31,65.79 90 top
R15  RESISTOR_0603_36.5K  [0603-RES]  76.45,65.79 90 top
R16  RESISTOR_0603_4.64K  [0603-RES]  76.45,62.74 90 top
R23  RESISTOR_0603_180  [0603-RES]  78.23,83.82 0 top
R24  RESISTOR_0603_2K  [0603-RES]  104.14,86.61 180 top
R25  RESISTOR_0603_2K  [0603-RES]  90.42,89.66 270 top
R26  RESISTOR_0603_2K  [0603-RES]  81.28,89.41 270 top
R27  RESISTOR_0603_2K  [0603-RES]  72.14,89.66 270 top
R28  RESISTOR_0603_2K  [0603-RES]  62.99,89.66 270 top
R29  RESISTOR_0603_2K  [0603-RES]  96.52,83.82 180 top
R30  RESISTOR_0603_2K  [0603-RES]  87.38,83.82 180 top
R31  RESISTOR_0603_180  [0603-RES]  38.1,43.43 270 top
R32  RESISTOR_0603_2K  [0603-RES]  69.09,83.82 180 top
R33  RESISTOR_0603_10K  [0603-RES]  55.37,96.27 180 bottom
R34  RESISTOR_0603_120  [0603-RES]  59.94,83.82 180 top
R37  RESISTOR_0603_240  [0603-RES]  38.1,46.48 270 top
R38  RESISTOR_0603_2K  [0603-RES]  53.85,89.66 270 top
R39  RESISTOR_0603_1K  [0603-RES]  23.62,32.77 0 top
R40  RESISTOR_0603_240  [0603-RES]  38.1,40.39 270 top
R41  RESISTOR_0603_43K  [0603-RES]  23.62,34.29 180 top
R42  RESISTOR_0603_10K  [0603-RES]  67.06,46.74 180 top
R43  RESISTOR_0603_2.55K  [0603-RES]  67.06,45.21 0 top
R54  RESISTOR_0603_240  [0603-RES]  38.1,37.34 270 top
R55  RESISTOR_0603_240  [0603-RES]  38.1,49.53 270 top
R57  RESISTOR_0603_2K  [0603-RES]  71.63,6.6 180 top
R58  RESISTOR_0603_1K  [0603-RES]  23.62,31.24 0 top
R59  RESISTOR_0603_43K  [0603-RES]  24.64,29.72 0 top
R60  RESISTOR_0603_10K  [0603-RES]  30.73,30.23 0 top
R61  RESISTOR_0603_10K  [0603-RES]  27.69,30.23 0 top
R62  RESISTOR_0603_1.13K  [0603-RES]  22.35,48.01 0 top
R63  RESISTOR_0603_10.2K  [0603-RES]  25.4,48.01 0 top
R64  RESISTOR_0603_5.1K  [0603-RES]  60.2,89.15 180 bottom
R65  RESISTOR_0603_10K  [0603-RES]  54.36,89.92 90 bottom
R66  RESISTOR_0603_5.1K  [0603-RES]  60.2,87.63 0 bottom
R67  RESISTOR_0603_2K  [0603-RES]  58.42,6.6 180 top
R70  RESISTOR_0603_2K  [0603-RES]  61.72,6.6 0 top
R71  RESISTOR_0603_2K  [0603-RES]  65.02,6.6 180 top
R72  RESISTOR_0603_2K  [0603-RES]  68.33,6.6 180 top
R74  RESISTOR_0603_1.13K  [0603-RES]  25.4,54.61 0 top
R75  RESISTOR_0603_10.2K  [0603-RES]  22.35,54.61 0 top
R80  RESISTOR_0603_13K  [0603-RES]  8.64,56.13 180 top
R81  RESISTOR_0603_3.3K  [0603-RES]  8.64,54.61 0 top
R82  RESISTOR_0603_13K  [0603-RES]  8.64,48.51 180 top
R83  RESISTOR_0603_3.3K  [0603-RES]  8.64,46.99 0 top
R84  RESISTOR_0603_13K  [0603-RES]  27.18,77.98 180 bottom
R85  RESISTOR_0603_3.3K  [0603-RES]  27.18,76.45 0 bottom
R86  RESISTOR_0603_13K  [0603-RES]  41.91,80.26 180 bottom
R87  RESISTOR_0603_3.3K  [0603-RES]  41.91,78.74 0 bottom
R88  RESISTOR_0603_13K  [0603-RES]  8.64,40.89 180 top
R89  RESISTOR_0603_3.3K  [0603-RES]  8.64,39.37 0 top
R90  RESISTOR_0603_13K  [0603-RES]  27.18,85.6 180 bottom
R91  RESISTOR_0603_3.3K  [0603-RES]  27.18,84.07 0 bottom
R92  RESISTOR_0603_100K  [0603-RES]  8.64,69.85 0 top
R93  RESISTOR_0603_100K  [0603-RES]  8.64,95.25 0 top
R95  RESISTOR_0603_100K  [0603-RES]  8.64,88.9 0 top
R97  RESISTOR_0603_100K  [0603-RES]  8.64,82.55 0 top
R98  RESISTOR_0603_10K  [0603-RES]  24.64,96.77 180 top
R99  RESISTOR_0603_100K  [0603-RES]  8.64,76.2 0 top
R100  RESISTOR_0603_10K  [0603-RES]  27.69,96.77 180 top
R103  RESISTOR_0603_10K  [0603-RES]  24.64,101.6 180 top
R104  RESISTOR_0603_10K  [0603-RES]  27.69,101.6 180 top
R105  RESISTOR_0603_13K  [0603-RES]  39.88,73.41 0 bottom
R106  RESISTOR_0603_3.3K  [0603-RES]  39.88,71.88 0 bottom
R107  RESISTOR_0603_10K  [0603-RES]  36.83,73.41 180 bottom
R108  RESISTOR_0603_10K  [0603-RES]  33.78,73.41 180 bottom
R109  RESISTOR_0603_13K  [0603-RES]  39.88,68.83 0 bottom
R110  RESISTOR_0603_3.3K  [0603-RES]  39.88,67.31 0 bottom
R111  RESISTOR_0603_10K  [0603-RES]  36.83,68.83 180 bottom
R112  RESISTOR_0603_10K  [0603-RES]  33.78,68.83 180 bottom
R113  RESISTOR_0603_13K  [0603-RES]  23.11,91.95 0 top
R114  RESISTOR_0603_3.3K  [0603-RES]  23.11,90.42 0 top
R115  RESISTOR_0603_10K  [0603-RES]  26.16,91.95 180 top
R116  RESISTOR_0603_10K  [0603-RES]  29.21,91.95 180 top
R117  RESISTOR_0603_13K  [0603-RES]  27.18,101.09 0 bottom
R118  RESISTOR_0603_3.3K  [0603-RES]  27.18,99.57 0 bottom
R119  RESISTOR_0603_10K  [0603-RES]  24.13,101.09 180 bottom
R120  RESISTOR_0603_10K  [0603-RES]  21.08,101.09 180 bottom
R121  RESISTOR_0603_13K  [0603-RES]  27.18,96.52 0 bottom
R122  RESISTOR_0603_3.3K  [0603-RES]  27.18,95 0 bottom
R123  RESISTOR_0603_10K  [0603-RES]  24.13,96.52 180 bottom
R124  RESISTOR_0603_10K  [0603-RES]  21.08,96.52 180 bottom
R125  RESISTOR_0603_13K  [0603-RES]  27.18,91.95 0 bottom
R126  RESISTOR_0603_3.3K  [0603-RES]  27.18,90.42 0 bottom
R127  RESISTOR_0603_10K  [0603-RES]  24.13,91.95 180 bottom
R128  RESISTOR_0603_10K  [0603-RES]  21.08,91.95 180 bottom
R129  RESISTOR_0603_4.64K  [0603-RES]  83.31,62.74 90 top
R130  RESISTOR_0603_36.5K  [0603-RES]  62.74,65.79 90 top
R131  RESISTOR_0603_4.64K  [0603-RES]  62.74,62.74 90 top
R132  RESISTOR_0603_36.5K  [0603-RES]  69.6,65.79 90 top
R133  RESISTOR_0603_4.64K  [0603-RES]  69.6,62.74 90 top
R134  RESISTOR_0603_36.5K  [0603-RES]  104.14,84.58 0 top
R135  RESISTOR_0603_4.64K  [0603-RES]  104.14,82.8 180 top
R136  RESISTOR_0603_36.5K  [0603-RES]  92.71,90.42 0 top
R137  RESISTOR_0603_4.64K  [0603-RES]  92.71,88.9 180 top
R138  RESISTOR_0603_36.5K  [0603-RES]  83.57,90.17 0 top
R139  RESISTOR_0603_4.64K  [0603-RES]  83.57,88.65 180 top
R140  RESISTOR_0603_36.5K  [0603-RES]  74.42,90.42 0 top
R141  RESISTOR_0603_4.64K  [0603-RES]  74.42,88.9 180 top
R142  RESISTOR_0603_36.5K  [0603-RES]  65.28,90.42 0 top
R143  RESISTOR_0603_4.64K  [0603-RES]  65.28,88.9 180 top
R144  RESISTOR_0603_36.5K  [0603-RES]  56.13,90.42 0 top
R145  RESISTOR_0603_4.64K  [0603-RES]  56.13,88.9 180 top
R146  RESISTOR_0603_36.5K  [0603-RES]  90.17,65.79 90 top
R147  RESISTOR_0603_4.64K  [0603-RES]  90.17,62.74 90 top
RTK  LED_0603_RED  [0603-LED]  68.33,5.08 180 top
S1  BUTTON  [B3S-100X]  104.14,92.96 90 top
SWOK  LED_0603_ORANGE  [0603-LED]  59.94,81.79 180 top
TP1  TEST_POINT  [5015]  30.23,59.18 180 top
TP2  TEST_POINT  [5015]  54.61,80.77 180 top
TP3  TEST_POINT  [5015]  46.99,80.77 180 top
TP4  TEST_POINT  [5015]  35.31,59.18 180 top
TP5  TEST_POINT  [5015]  14.22,33.53 180 top
TP6  TEST_POINT  [5015]  14.22,29.97 180 top
TP7  TEST_POINT  [5015]  40.39,55.63 180 top
TP8  TEST_POINT  [5015]  35.31,55.63 180 top
U1  VOLTAGE_REGULATOR_SOT-223_3.3V  [SOT-223]  40.13,82.04 90 top
U2  TCAN1051HQV-Q1  [SOIC-08(NARROW,0.15")]  98.55,62.23 0 bottom
U3  TCAN1051HQV-Q1  [SOIC-08(NARROW,0.15")]  91.19,74.68 180 bottom
U4  TCAN1051HQV-Q1  [SOIC-08(NARROW,0.15")]  50.29,63.75 90 top
U5  ADM8316WBX30  [SOT-23-5]  54.86,98.81 270 bottom
U6  ADC128S022  [TSSOP-16]  25.91,80.52 0 top
U7  ADC128S022  [TSSOP-16]  22.1,69.85 90 bottom
U8  OPAMP_1_CHANNEL_OPA991  [SC-70-5]  23.88,56.64 270 top
U9  OPAMP_1_CHANNEL_OPA991  [SC-70-5]  23.88,45.97 270 top
U10  OPAMP_1_CHANNEL_OPA991  [SC-70-5]  23.88,52.58 270 top
U11  LOGICGATE_OR  [SC-70-5]  29.46,53.09 270 top
U12  LOGICGATE_OR  [SC-70-5]  29.46,50.55 270 top
U13  LOGICGATE_OR  [SC-70-5]  29.46,48.01 270 top
U14  MAX7400  [SOIC-08(NARROW,0.15")]  13.72,54.61 270 top
U15  MAX7400  [SOIC-08(NARROW,0.15")]  13.72,46.99 270 top
U16  MAX7400  [SOIC-08(NARROW,0.15")]  22.1,76.45 270 bottom
U17  MAX7400  [SOIC-08(NARROW,0.15")]  36.83,78.74 270 bottom
U18  MAX7400  [SOIC-08(NARROW,0.15")]  13.72,39.37 270 top
U19  MAX7400  [SOIC-08(NARROW,0.15")]  22.1,84.07 270 bottom
U20  MAX7400  [SOIC-08(NARROW,0.15")]  13.72,94.49 270 top
U21  MAX7400  [SOIC-08(NARROW,0.15")]  13.72,88.14 270 top
U22  MAX7400  [SOIC-08(NARROW,0.15")]  13.72,81.79 270 top
U23  ADC128S022  [TSSOP-16]  13.72,62.48 90 top
U24  MAX7400  [SOIC-08(NARROW,0.15")]  13.72,75.44 270 top
U25  MAX7400  [SOIC-08(NARROW,0.15")]  13.72,69.09 270 top
U26  TCAN1051HQV-Q1  [SOIC-08(NARROW,0.15")]  50.04,43.69 90 top
U27  OPAMP_1_CHANNEL_OPA991  [SC-70-5]  23.88,43.43 270 top
U28  LOGICGATE_OR  [SC-70-5]  29.46,45.47 270 top
U29  TCAN1051HQV-Q1  [SOIC-08(NARROW,0.15")]  97.79,74.68 270 bottom
U30  TCAN1051HQV-Q1  [SOIC-08(NARROW,0.15")]  91.95,62.23 90 bottom
U32  ADC128S022  [TSSOP-16]  75.18,43.69 270 top
U34  OPAMP_1_CHANNEL_OPA991  [SC-70-5]  26.92,32.26 270 top
U37  OPAMP_1_CHANNEL_OPA991  [SC-70-5]  30.73,32.26 270 top
U38  LOGICGATE_OR  [SC-70-5]  34.04,49.28 270 top
U39  OPAMP_1_CHANNEL_OPA991  [SC-70-5]  23.88,50.04 270 top
U41  OPAMP_1_CHANNEL_OPA991  [SC-70-5]  23.88,36.58 270 top
U42  LOGICGATE_AND_DCK3  [SC-70-5]  34.04,34.8 270 top
U43  OPAMP_1_CHANNEL_OPA991  [SC-70-5]  23.88,39.37 270 top
U44  LOGICGATE_NOR  [SC-70-5]  34.04,45.72 270 top
U$3  [LOGO_HYTECH_MEDIUM]  74.42,1.91 0 top
U$5  [LOGO_GT_SMALL]  52.07,5.08 0 top
U$9  [MOUNTING_M3]  5.08,102.87 0 top
U$10  [MOUNTING_M3]  5.08,30.48 0 top
U$11  [MOUNTING_M3]  104.14,102.87 0 top
U$12  [MOUNTING_M3]  104.14,5.08 0 top
VR1  RESISTOR_TRIMPOT_10K_3362P  [3362P]  31.75,40.13 90 top
WDOG  LED_0603_ORANGE  [0603-LED]  69.09,81.79 180 top
XB1  BATTERY_HOLDER_KEYSTONE_498  [498]  38.35,15.24 270 top